# Altium project aig2_main.PrjPcb
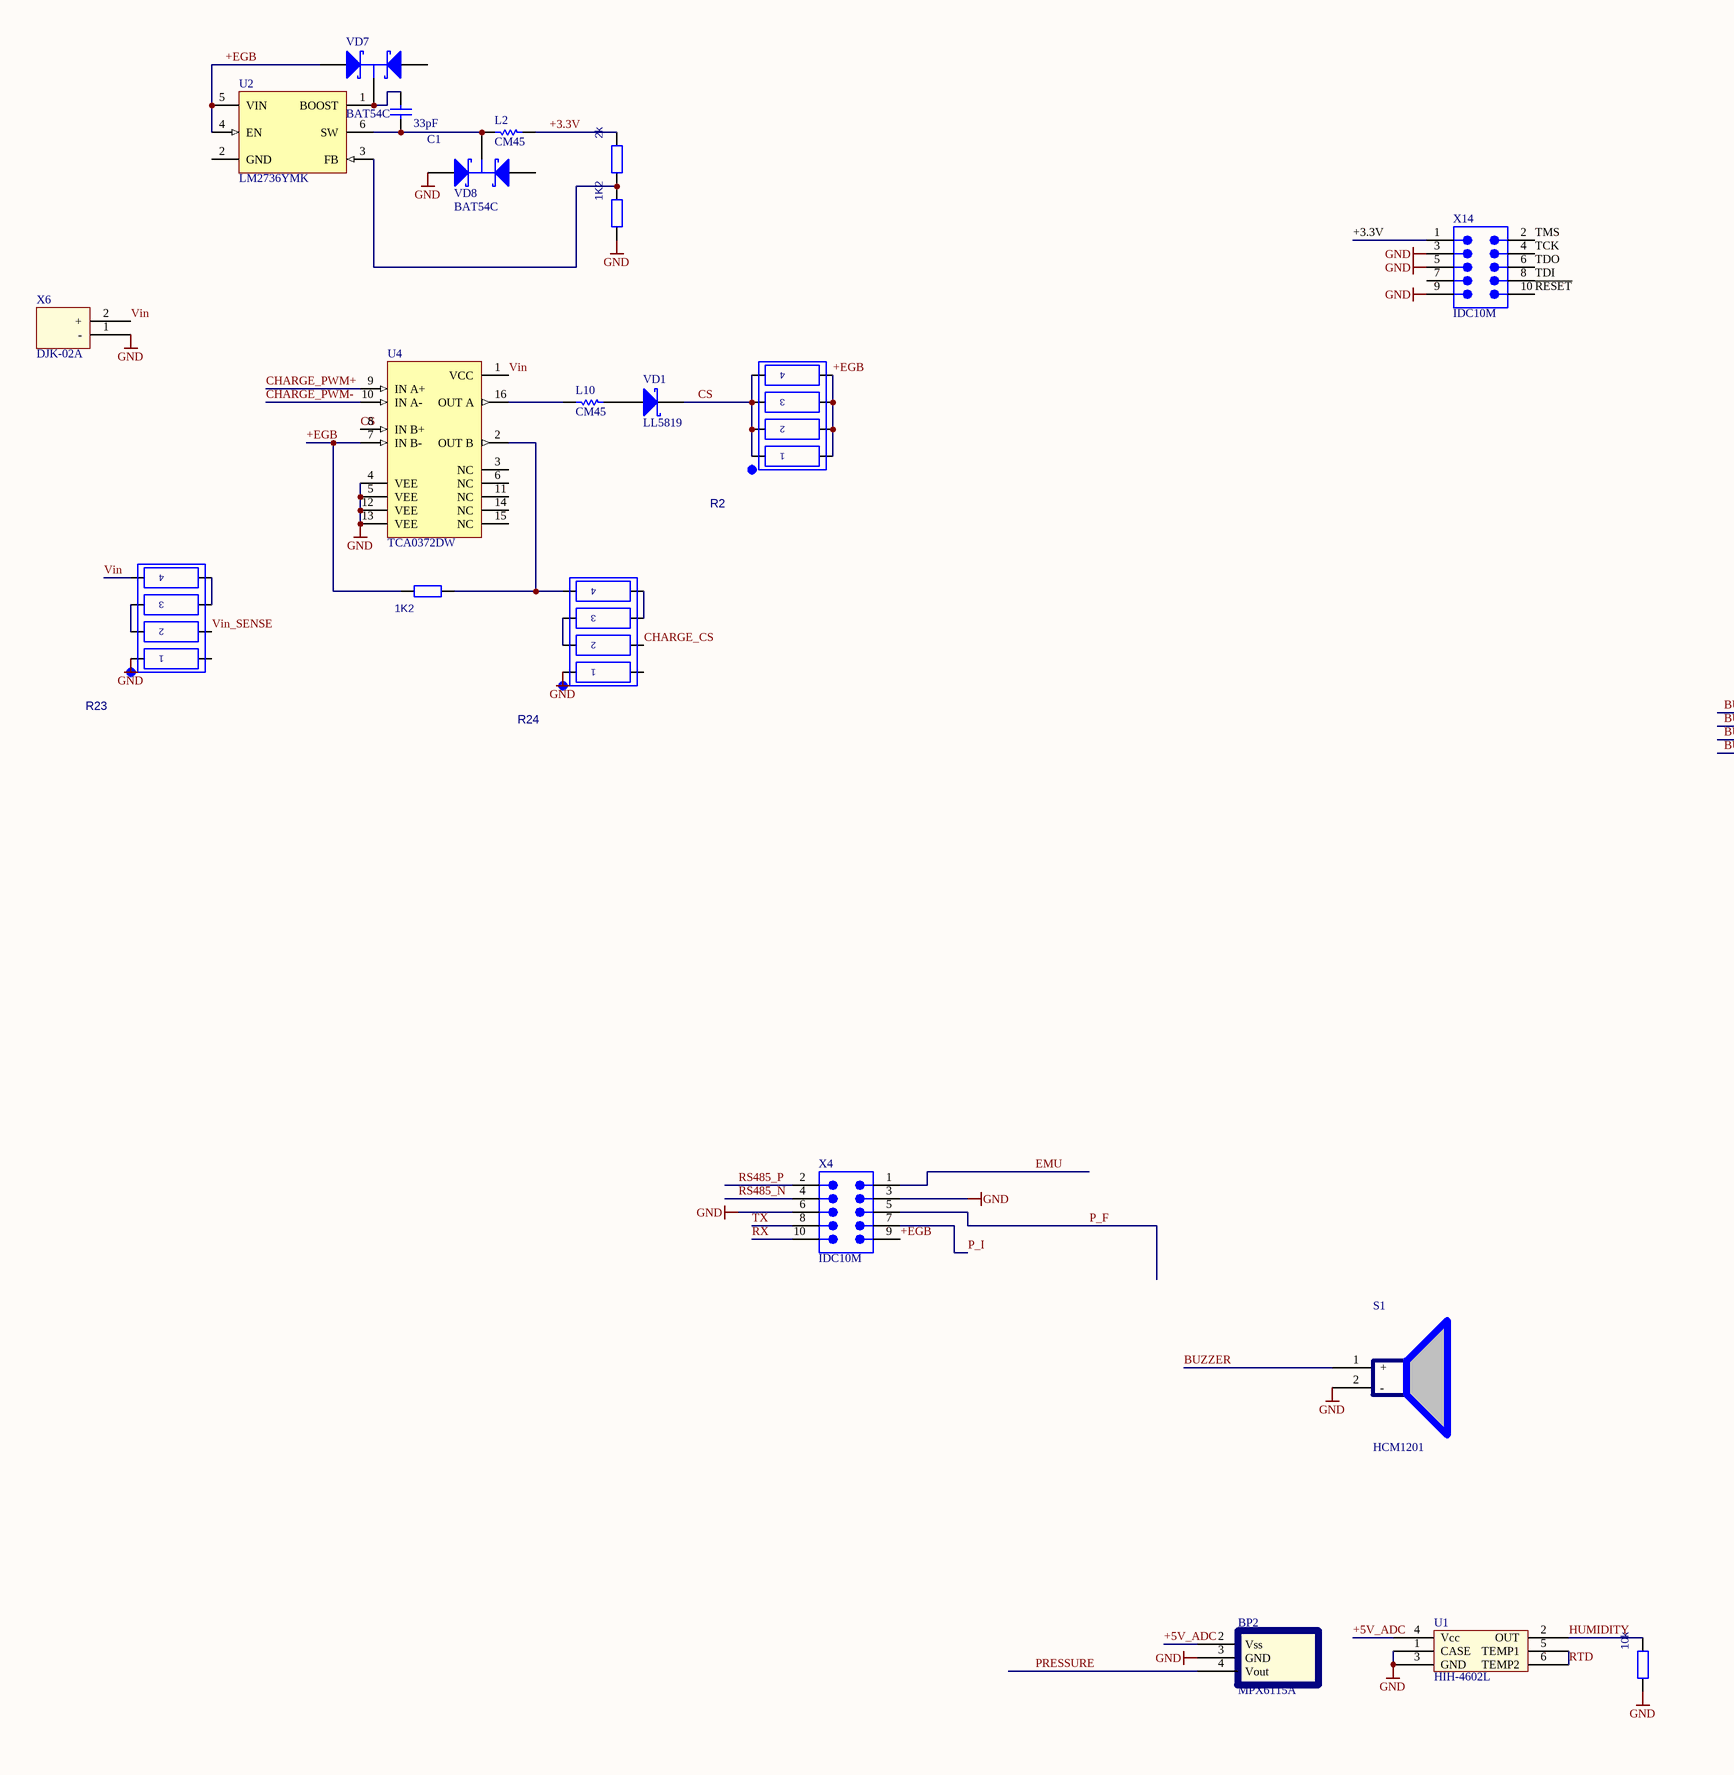
[diagram p0: aig2_main.SchDoc, left]
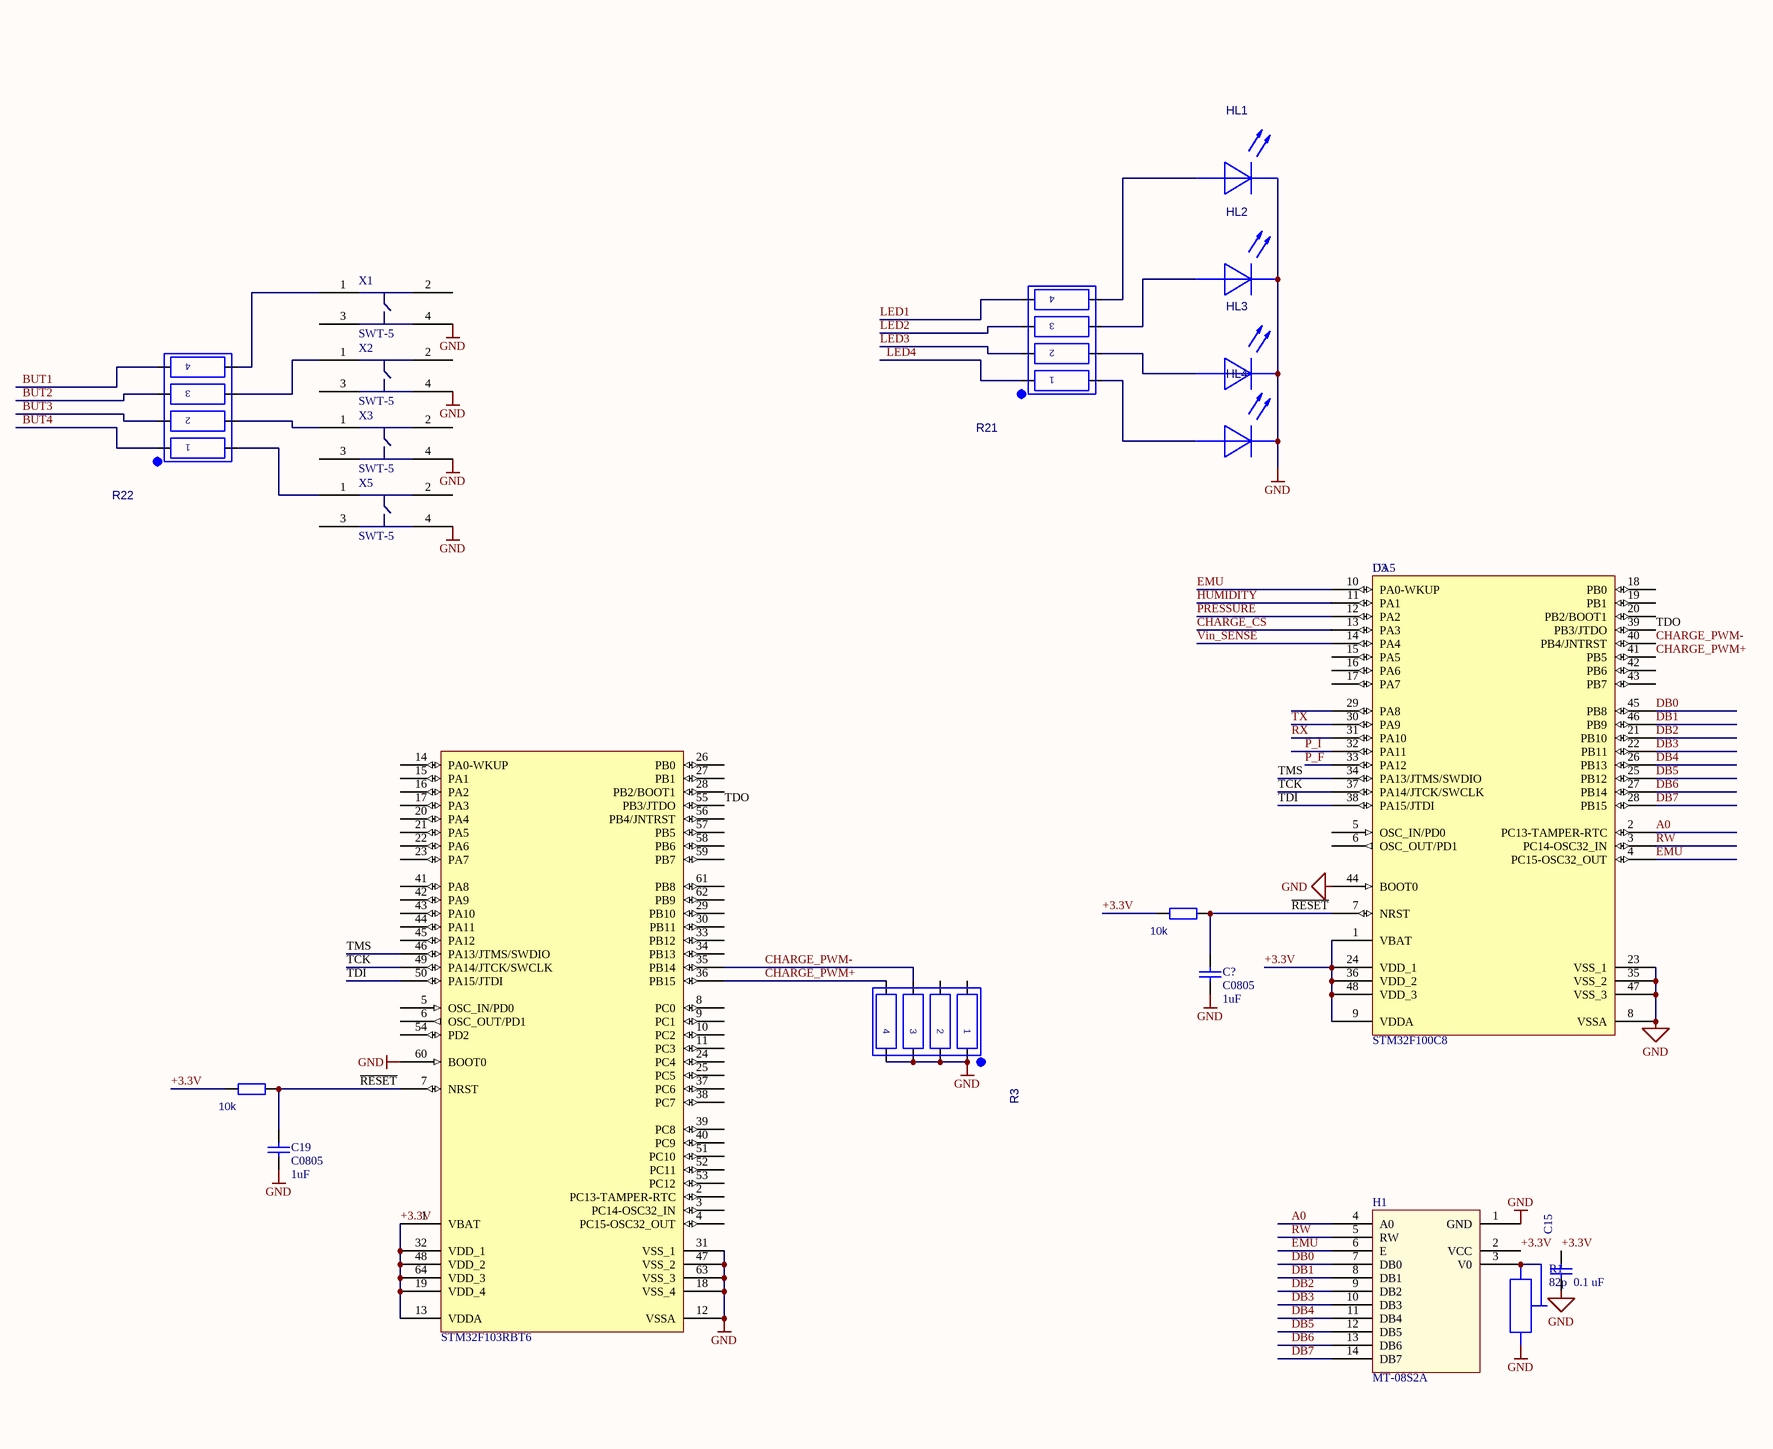
[diagram p1: aig2_main.SchDoc, right]
1 sheet, 41 parts. Net scope: global (net labels, ports and power ports of the same name join across sheets).
Board file: aig2_main.PcbDoc

## Sheet aig2_main.SchDoc
size A0

### Parts
BP2  MPX6115A  [MPX_SOP8]
C1  value 33pF  [CC0805]  (hidden comment: C0805)
C15  value 0.1 uF  [CC0805]  (hidden comment: C0805)
C19  C0805  value 1uF  [CC0805]
C?  C0805  value 1uF  [CC0805]
DA5  STM32F100C8  [LQFP48_N]
H1  MT-08S2A  [MT-08S2A]
HL1  LED2.54  [LED2.54_LED2.54(Primary)]  (value not drawn)
HL2  LED2.54  [LED2.54_LED2.54(Primary)]  (value not drawn)
HL3  LED2.54  [LED2.54_LED2.54(Primary)]  (value not drawn)
HL4  LED2.54  [LED2.54_LED2.54(Primary)]  (value not drawn)
L2  CM45  [12-1812]
L10  CM45  [12-1812]
R1  82p  [82p]
R2  CAY16-J4  [CAY16-F4]  (value not drawn)
R3  CAY16-J4  [CAY16-F4]  (value not drawn)
R18  value 10k  [RR0805]
R21  CAY16-J4  [CAY16-F4]  (value not drawn)
R22  CAY16-J4  [CAY16-F4]  (value not drawn)
R23  CAY16-J4  [CAY16-F4]  (value not drawn)
R24  CAY16-J4  [CAY16-F4]  (value not drawn)
R37  value 10k  [RR0805]
R38  value 2k  [RR0805]
R39  value 1K2  [RR0805]
R40  value 1K2  [RR0805]
R?  value 10k  [RR0805]
S1  HCM1201  [HCM1201]
U1  HIH-4602L  [HIH-4602L]  (no BOM)
U2  LM2736YMK  [MK06A_N]
U3  STM32F103RBT6  [LQFP64_N]
U4  TCA0372DW  [751G-02_N]
VD1  LL5819  [SMB]
VD7  BAT54C  [SOT23]
VD8  BAT54C  [SOT23]
X1  SWT-5  [SWT-5]
X2  SWT-5  [SWT-5]
X3  SWT-5  [SWT-5]
X4  IDC10M  [idc10_2]
X5  SWT-5  [SWT-5]
X6  DJK-02A  [DJK-02A]
X14  IDC10M  [idc10_2]

### Nets
GND: BP2.3(GND) C15.1 C19.1 C?.1 DA5.8(VSSA) DA5.23(VSS_1) DA5.35(VSS_2) DA5.44(BOOT0) DA5.47(VSS_3) H1.1(GND) HL1.1(K) HL2.1(K) HL3.1(K) HL4.1(K) R1.3(I/O) R3.1(I/O0) R3.3(I/O0) R3.5(I/O0) R3.7(I/O0) R23.5(I/O0) R24.5(I/O0) R37.2 R39.2 S1.2(-) U1.1(CASE) U1.3(GND) U3.12(VSSA) U3.18(VSS_4) U3.31(VSS_1) U3.47(VSS_2) U3.60(BOOT0) U3.63(VSS_3) U4.4(VEE) U4.5(VEE) U4.12(VEE) U4.13(VEE) VD8.2(A2) X1.4 X2.4 X3.4 X4.3 X4.6 X5.4 X6.1(-) X14.3 X14.5 X14.9
+3.3V: C15.2 DA5.1(VBAT) DA5.9(VDDA) DA5.24(VDD_1) DA5.36(VDD_2) DA5.48(VDD_3) H1.2(VCC) L2.1 R18.1 R38.1 R?.1 U3.1(VBAT) U3.13(VDDA) U3.19(VDD_4) U3.32(VDD_1) U3.48(VDD_2) U3.64(VDD_3) X14.1
+5V_ADC: BP2.2(Vss) U1.4(Vcc)
+EGB: R2.2(I/O1) R2.4(I/O1) R2.6(I/O1) R2.8(I/O1) R40.1 U2.4(EN) U2.5(VIN) U4.7(IN_B-) VD7.1(A1) X4.9
A0: DA5.2(PC13-TAMPER-RTC) H1.4(A0)
BUT1: R22.3(I/O0)
BUT2: R22.1(I/O0)
BUT3: R22.7(I/O0)
BUT4: R22.5(I/O0)
BUZZER: S1.1(+)
CHARGE_CS: DA5.13(PA3) R24.4(I/O1)
CHARGE_PWM+: DA5.41(PB5) R3.8(I/O1) U3.36(PB15) U4.9(IN_A+)
CHARGE_PWM-: DA5.40(PB4/JNTRST) R3.6(I/O1) U3.35(PB14) U4.10(IN_A-)
CS: R2.1(I/O0) R2.3(I/O0) R2.5(I/O0) R2.7(I/O0) U4.8(IN_B+) VD1.2(K)
DB0: DA5.45(PB8) H1.7(DB0)
DB1: DA5.46(PB9) H1.8(DB1)
DB2: DA5.21(PB10) H1.9(DB2)
DB3: DA5.22(PB11) H1.10(DB3)
DB4: DA5.26(PB13) H1.11(DB4)
DB5: DA5.25(PB12) H1.12(DB5)
DB6: DA5.27(PB14) H1.13(DB6)
DB7: DA5.28(PB15) H1.14(DB7)
EMU: DA5.4(PC15-OSC32_OUT) DA5.10(PA0-WKUP) H1.6(E) X4.1
HUMIDITY: DA5.11(PA1) R37.1 U1.2(OUT)
LED1: R21.3(I/O0)
LED2: R21.1(I/O0)
LED3: R21.7(I/O0)
LED4: R21.5(I/O0)
P_F: DA5.33(PA12) X4.5
P_I: DA5.32(PA11) X4.7
PRESSURE: BP2.4(Vout) DA5.12(PA2)
~{RESET}: C19.2 C?.2 DA5.7(NRST) R18.2 R?.2 U3.7(NRST) X14.10
RS485_N: X4.4
RS485_P: X4.2
RTD: U1.5(TEMP1) U1.6(TEMP2)
RW: DA5.3(PC14-OSC32_IN) H1.5(RW)
RX: DA5.31(PA10) X4.10
TCK: DA5.37(PA14/JTCK/SWCLK) U3.49(PA14/JTCK/SWCLK) X14.4
TDI: DA5.38(PA15/JTDI) U3.50(PA15/JTDI) X14.8
TDO: DA5.39(PB3/JTDO) U3.55(PB3/JTDO) X14.6
TMS: DA5.34(PA13/JTMS/SWDIO) U3.46(PA13/JTMS/SWDIO) X14.2
TX: DA5.30(PA9) X4.8
Vin: R23.3(I/O0) U4.1(VCC) X6.2(+)
Vin_SENSE: DA5.14(PA4) R23.4(I/O1)
NetC1_1: C1.1 L2.2 U2.6(SW) VD8.3(K)
NetC1_2: C1.2 U2.1(BOOST) VD7.3(K)
NetH1_3: H1.3(V0) R1.1(I/O1) R1.2(I/O0)
NetHL1_2: HL1.2(A) R21.8(I/O1)
NetHL2_2: HL2.2(A) R21.6(I/O1)
NetHL3_2: HL3.2(A) R21.4(I/O1)
NetHL4_2: HL4.2(A) R21.2(I/O1)
NetL10_1: L10.1 VD1.1(A)
NetL10_2: L10.2 U4.16(OUT_A)
NetR22_2: R22.2(I/O1) X5.1
NetR22_4: R22.4(I/O1) X3.1
NetR22_6: R22.6(I/O1) X2.1
NetR22_8: R22.8(I/O1) X1.1
NetR23_1: R23.1(I/O0) R23.7(I/O0)
NetR23_6: R23.6(I/O1) R23.8(I/O1)
NetR24_1: R24.1(I/O0) R24.7(I/O0)
NetR24_3: R24.3(I/O0) R40.2 U4.2(OUT_B)
NetR24_6: R24.6(I/O1) R24.8(I/O1)
NetR38_2: R38.2 R39.1 U2.3(FB)

Not connected (* = marked no-connect by the designer): DA5 5(OSC_IN/PD0) 6(OSC_OUT/PD1) 15(PA5) 16(PA6) 17(PA7) 18(PB0) 19(PB1) 20(PB2/BOOT1) 29(PA8) 42(PB6) 43(PB7); R3 2(I/O1) 4(I/O1); R23 2(I/O1); R24 2(I/O1); U2 2(GND); U3 2(PC13-TAMPER-RTC) 3(PC14-OSC32_IN) 4(PC15-OSC32_OUT) 5(OSC_IN/PD0) 6(OSC_OUT/PD1) 8(PC0) 9(PC1) 10(PC2) 11(PC3) 14(PA0-WKUP) 15(PA1) 16(PA2) 17(PA3) 20(PA4) 21(PA5) 22(PA6) 23(PA7) 24(PC4) 25(PC5) 26(PB0) 27(PB1) 28(PB2/BOOT1) 29(PB10) 30(PB11) 33(PB12) 34(PB13) 37(PC6) 38(PC7) 39(PC8) 40(PC9) 41(PA8) 42(PA9) 43(PA10) 44(PA11) 45(PA12) 51(PC10) 52(PC11) 53(PC12) 54(PD2) 56(PB4/JNTRST) 57(PB5) 58(PB6) 59(PB7) 61(PB8) 62(PB9); U4 3(NC) 6(NC) 11(NC) 14(NC) 15(NC); VD7 2(A2); VD8 1(A1); X1 2 3; X2 2 3; X3 2 3; X5 2 3; X14 7

### Library data of the parts
BP2 = MPXH6115A: Микросхема
C1 C15 C19 C? = C0805: Ceramic Chip Capacitor - Standard; Note: Footprint corresponds to dimensions for bulk cassette packaging. This case size has tightened tolerances.; Published: 17-Jul-2002; LatestRevisionDate: 19-Mar-2004; LatestRevisionNote: Silkscreen size reduced.; DatasheetDocument: Mar-2001; PackageDocument: Mar-2001; PackageReference: 0805; Publisher: Altium Limited; Code_JEITA: 0805; Code_IPC: 2012[0805]; ComponentLink1Description: Manufacturer Link; ComponentLink1URL: http://www.kemet.com/; ComponentLink2Description: Datasheet; ComponentLink2URL: http://www.kemet.com/kemet/web/homepage/kechome.nsf/vapubfilesname/F3102TA.pdf/$file/F3102TA.pdf
DA5 = STM32F101C6T6: STM32 ARM-based 32-bit MCU with 32 Kbytes Flash, 48-pin LQFP, Industrial Temperature; Published: 30-May-2008; DatasheetVersion: rev6, Mar-2008; PackageVersion: Mar-2008; PackageReference: LQFP48; Publisher: Altium Limited; PackageDescription: 48-Pin Low-Profile Quad Flat Pack, 7 x 7 mm Body, 0.5 mm Pitch (LQFP48); ComponentLink1Description: Manufacturer Link; ComponentLink1URL: www.st.com/stm32; ComponentLink2Description: Datasheet; ComponentLink2URL: http://www.st.com/stonline/products/literature/ds/13586.pdf
H1 = MT-08S2A: Индикатор  ЖК
L2 L10 = ERJL12: Дроссель; Value: 10uH; Published: 17-Dec-2003; LatestRevisionDate: 19-Mar-2004; LatestRevisionNote: Silkscreen size reduced.; PackageDocument: Mar-2003; PackageReference: 12-1812; Publisher: Altium Limited; ComponentLink1Description: Manufacturer Link; ComponentLink1URL: http://www.panasonic.com/industrial/components/resistive_products.htm; ComponentLink2Description: Datasheet; ComponentLink2URL: http://www.panasonic.com/industrial/components/pdf/AOA0000CE3.pdf
R1 = 82p: Резистор; Value: *
R2 R3 R21-R24 = CAY16-J4: Value: 1k
R18 R? = R_0805: Price: {Price}
R37-R40 = R_0805: Резистор; Price: {Price}
S1 = HCM1201: ПьезоБуззер
U1 = HIH-4602L: Датчик влажности
U2 = LM2736YMK: Thin SOT23 750mA Load Step-Down DC-DC Regulator; Manufacturer: National Semiconductor; CompType: Switcher; PackageTopMarking: SHBB*XTT; PowerWise: N; FirstPublished: 4-Dec-2008; DatasheetVersion: Jan-2005; PackageVersion: revD, Jul-2005; PackageReference: MK06A; Publisher: Altium Limited; PackageDescription: Molded TSOT, 2.97 x 1.65 x 0.87mm Body, 6 Lead, 0.95mm Pitch; PartNumber: LM2736YMK; RoHS: O; PinCount: 6; DigiKeyPartNumber: LM2736YMKCT-ND; Code_JEDEC: MO-193-AA; Code_IPC: SOT26A-6; ComponentLink1Description: LM2736 Datasheet; ComponentLink1URL: http://www.national.com/ds/LM/LM2736.pdf; ComponentLink2Description: LM2736 Web Page; ComponentLink2URL: http://www.national.com/pf/LM/LM2736.html; ComponentLink3Description: MK06A Package Page; ComponentLink3URL: http://www.national.com/packaging/folders/mk06a.html
U3 = STM32F103RBT6: STM32 ARM-based 32-bit MCU with 128 Kbytes Flash, 64-pin LQFP, Industrial Temperature; Published: 30-May-2008; DatasheetVersion: rev6, Mar-2008; PackageVersion: Mar-2008; PackageReference: LQFP64; Publisher: Altium Limited; PackageDescription: 64-Pin Low-Profile Quad Flat Pack, 10 x 10 mm Body, 0.5 mm Pitch (LQFP64); ComponentLink1Description: Manufacturer Link; ComponentLink1URL: www.st.com/stm32; ComponentLink2Description: Datasheet; ComponentLink2URL: http://www.st.com/stonline/products/literature/ds/13587.pdf
U4 = TCA0372DW: Dual Power Operational Amplifier; Published: 17-Jul-2002; LatestRevisionDate: 13-Apr-2006; LatestRevisionNote: IPC-7351 Footprint Added.; DatasheetVersion: 1999; PackageVersion: 1996; PackageReference: 751G-02; Publisher: Altium Limited; PackageDescription: 16-Pin Small Outline Integrated Circuit 1.27 mm Pitch; ComponentLink1Description: Manufacturer Link; ComponentLink1URL: http://www.onsemi.com/site/products/parametrics/0,4446,251,00.html; ComponentLink2Description: Datasheet; ComponentLink2URL: http://www.onsemi.com/pub/Collateral/TCA0372-D.PDF
VD1 = 10BQ060: Schottky Rectifier; Published: 8-Jun-2000; LatestRevisionDate: 17-Jul-2002; LatestRevisionNote: Re-released for DXP Platform.; DatasheetDocument: PD-2.438A; PackageReference: SMB; Publisher: Altium Limited; ComponentLink1Description: Manufacturer Link; ComponentLink1URL: http://www.irf.com/; ComponentLink2Description: Datasheet; ComponentLink2URL: http://www.irf.com/product-info/datasheets/data/10bq60.pdf
VD7 VD8 = BAT54C: Schottky Barrier Double Diode; Published: 17-Sep-2003; LatestRevisionDate: 12-Dec-2006; LatestRevisionNote: IPC-7351 Footprint Added.; DatasheetVersion: 4-Mar-2002; PackageVersion: May-1999; PackageReference: SOT23; Publisher: Altium Limited; PackageDescription: 3-Pin SOT-23 Package 0.95 mm Pitch, 2.3 mm Lead Span; ComponentLink1Description: Manufacturer Link; ComponentLink1URL: http://www.semiconductors.philips.com/; ComponentLink2Description: Datasheet; ComponentLink2URL: http://www.semiconductors.philips.com/acrobat/datasheets/BAT54_SERIES_4.pdf
X1-X3 X5 = SWT-5: Кнопка
X4 X14 = 09 18 110 9621: Flat Cable Connector (IDC), PCB Transition Connector, 2 Rows, Solder Pin, 10 Contacts; PCB_Layout: Complies with manufacturer's recommendation.; DrillSize: Corresponds to nominal value.; Published: 15-Nov-2004; DatasheetDocument: Sep-2003; PackageDocument: 26-Nov-2003; PackageReference: 9181109621; Publisher: Altium Limited; ComponentLink1Description: Manufacturer Link; ComponentLink1URL: http://www.harting.com/; ComponentLink2Description: Selection Guide; ComponentLink2URL: http://www.harting.com/imperia/md/content/steckverbinderundsystemkomponenten/folder/interface_engl_chapter_09.pdf
X6 = DJK-02A: Разъем
HL1-HL4 = LED2.54: Value: *